# EAGLE schematic transmitter (EAGLE 9.2.0)
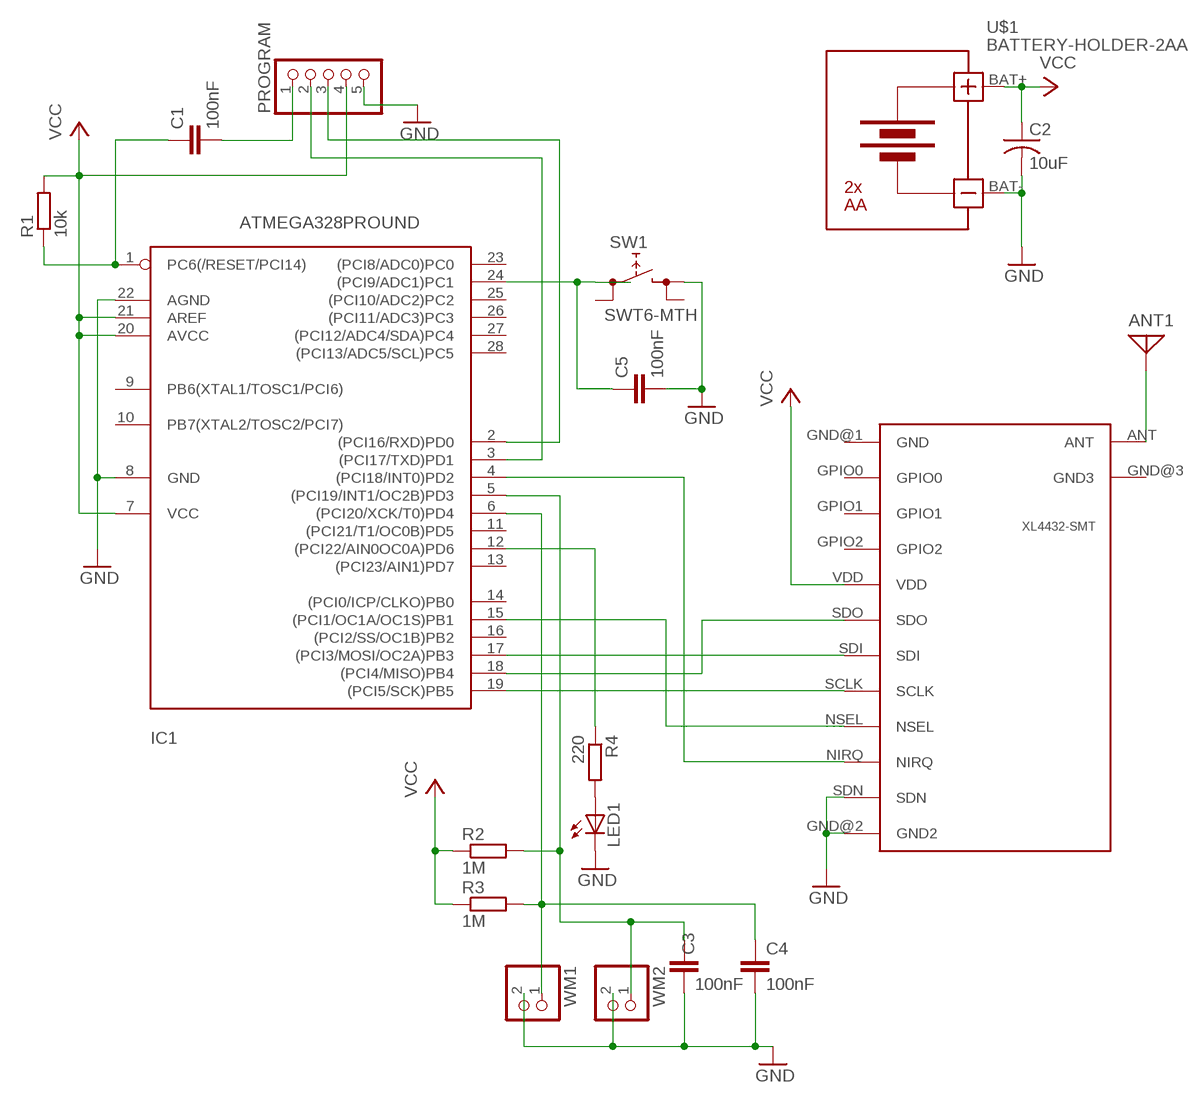
[diagram p0: schematic, sheet 1]

## Parts
4332-1  XM4432-SMT  [XL4432-SMT]
ANT1  ANTENNA  [PAD-01]
C1  100nF  C-EU025-024X044  [C025-024X044]
C2  10uF  C-US025-024X044  [C025-024X044]
C3  100nF  C-EU025-024X044  [C025-024X044]
C4  100nF  C-EU025-024X044  [C025-024X044]
C5  100nF  C-EU025-024X044  [C025-024X044]
IC1  ATMEGA328PROUND  [DIL28-3-ROUND]
LED1  LED3MM  [LED3MM]
PROGRAM  PINHD-1X5  [1X05]
R1  10k  R-EU_0204/2V  [0204V]
R2  1M  R-EU_0204/2V  [0204V]
R3  1M  R-EU_0204/2V  [0204V]
R4  220  R-EU_0204/2V  [0204V]
SW1  SWT6-MTH  [SWT6_M_TH]
U$1  BATTERY-HOLDER-2AA  [BATTERY-HOLDER-2AA]
WM1  PINHD-1X2/90  [1X02/90]
WM2  PINHD-1X2/90  [1X02/90]

## Nets
GND: 4332-1.GND@2(GND2) 4332-1.SDN C2.2 C3.2 C4.2 C5.2 IC1.8(GND) IC1.22(AGND) LED1.K(C) PROGRAM.5 SW1.P3 U$1.BAT- WM1.2 WM2.2
N$1: C1.2 PROGRAM.1
N$2: C1.1 IC1.1(PC6(/RESET/PCI14)) R1.1
N$3: IC1.3((PCI17/TXD)PD1) PROGRAM.2
N$4: IC1.2((PCI16/RXD)PD0) PROGRAM.3
N$5: C4.1 IC1.6((PCI20/XCK/T0)PD4) R3.2 WM1.1
N$6: C3.1 IC1.5((PCI19/INT1/OC2B)PD3) R2.2 WM2.1
N$7: 4332-1.SDO IC1.18((PCI4/MISO)PB4)
N$8: IC1.12((PCI22/AIN0OC0A)PD6) R4.1
N$9: 4332-1.SDI IC1.17((PCI3/MOSI/OC2A)PB3)
N$10: 4332-1.NSEL IC1.15((PCI1/OC1A/OC1S)PB1)
N$11: 4332-1.NIRQ IC1.4((PCI18/INT0)PD2)
N$12: C5.1 IC1.24((PCI9/ADC1)PC1) SW1.P1
N$13: LED1.A R4.2
N$14: 4332-1.SCLK IC1.19((PCI5/SCK)PB5)
N$15: 4332-1.ANT ANT1.1
VCC: 4332-1.VDD C2.1 IC1.7(VCC) IC1.20(AVCC) IC1.21(AREF) PROGRAM.4 R1.2 R2.1 R3.1 U$1.BAT+
Unconnected: 4332-1.GPIO0 4332-1.GPIO1 4332-1.GPIO2 IC1.9(PB6(XTAL1/TOSC1/PCI6)) IC1.10(PB7(XTAL2/TOSC2/PCI7)) IC1.11((PCI21/T1/OC0B)PD5) IC1.13((PCI23/AIN1)PD7) IC1.14((PCI0/ICP/CLKO)PB0) IC1.16((PCI2/SS/OC1B)PB2) IC1.23((PCI8/ADC0)PC0) IC1.25((PCI10/ADC2)PC2) IC1.26((PCI11/ADC3)PC3) IC1.27((PCI12/ADC4/SDA)PC4) IC1.28((PCI13/ADC5/SCL)PC5) SW1.P2 SW1.P4

## Power pins joined to a net without a drawn wire
GND: 4332-1.GND@1(GND)
GND3: 4332-1.GND@3(GND3)

## Library data of the parts
4332-1 = xl4432-smt:XM4432-SMT: XL4432-SMT Si4432 based transceiver Drawn by Will Cooke. Made available under the GPL. For full licence details please see the github page or read any copy of the GPL v2. Datasheet available here:http://www.silabs.com/Support%20Documents/TechnicalDocs/Si4430-31-32.pdf www.whizzy.org https://github.com/8none1 @8none1 <https://twitter.com/8none1>
ANT1 = discrete:ANTENNA: Antenna
C1 C3-C5 = rcl:C-EU: CAPACITOR, European symbol; SPICEPREFIX: C
C2 = rcl:C-US: CAPACITOR, American symbol; SPICEPREFIX: C
IC1 = atmega328:ATMEGA328*P: MICROCONTROLLER 32 kBytes FLASH 2 kBytes SRAM 1 kBytes EEPROM USART 8-channel 10 bit ADC
LED1 = led:LED: LED OSRAM: - CHIPLED LG R971, LG N971, LY N971, LG Q971, LY Q971, LO R971, LY R971 LH N974, LH R974 LS Q976, LO Q976, LY Q976 LO Q996 - Hyper CHIPLED LW Q18S LB Q993, LB Q99A, LB R99A - SideLED LS A670, LO A670, LY A670, LG A670, LP A670 LB A673, LV A673, LT A673, LW A673 LH A674 LY A675 LS A676, LA A676, LO A676, LY A676, LW A676 LS A679, LY A679, LG A679 - Hyper Micro SIDELED® LS Y876, LA Y876, LO Y876, LY Y876 LT Y87S - SmartLED LW L88C, LW L88S LB L89C, LB L89S, LG L890 LS L89K, LO L89K, LY L89K LS L896, LA L896, LO L896, LY L896 - TOPLED LS T670, LO T670, LY T670, LG T670, LP T670 LSG T670, LSP T670, LSY T670, LOP T670, LYG T670 LG T671, LOG T671, LSG T671 LB T673, LV T673, LT T673, LW T673 LH T674 LS T676, LA T676, LO T676, LY T676, LB T676, LH T676, LSB T676, LW T676 LB T67C, LV T67C, LT T67C, LS T67K, LO T67K, LY T67K, LW E67C LS E67B, LA E67B, LO E67B, LY E67B, LB E67C, LV E67C, LT E67C LW T67C LS T679, LY T679, LG T679 LS T770, LO T770, LY T770, LG T770, LP T770 LB T773, LV T773, LT T773, LW T773 LH T774 LS E675, LA E675, LY E675, LS T675 LS T776, LA T776, LO T776, LY T776, LB T776 LHGB T686 LT T68C, LB T68C - Hyper Mini TOPLED® LB M676 - Mini TOPLED Santana® LG M470 LS M47K, LO M47K, LY M47K Source: http://www.osram.convergy.de LUXEON: - LUMILED® LXK2-PW12-R00, LXK2-PW12-S00, LXK2-PW14-U00, LXK2-PW14-V00 LXK2-PM12-R00, LXK2-PM12-S00, LXK2-PM14-U00 LXK2-PE12-Q00, LXK2-PE12-R00, LXK2-PE12-S00, LXK2-PE14-T00, LXK2-PE14-U00 LXK2-PB12-K00, LXK2-PB12-L00, LXK2-PB12-M00, LXK2-PB14-N00, LXK2-PB14-P00, LXK2-PB14-Q00 LXK2-PR12-L00, LXK2-PR12-M00, LXK2-PR14-Q00, LXK2-PR14-R00 LXK2-PD12-Q00, LXK2-PD12-R00, LXK2-PD12-S00 LXK2-PH12-R00, LXK2-PH12-S00 LXK2-PL12-P00, LXK2-PL12-Q00, LXK2-PL12-R00 Source: www.luxeon.com KINGBRIGHT: KA-3528ASYC Source: www.kingbright.com
PROGRAM = pinhead:PINHD-1X5: PIN HEADER
R1-R4 = rcl:R-EU_: RESISTOR, European symbol; SPICEPREFIX: R
SW1 = tactile_switch:SWT6-M
U$1 = diy-modules:BATTERY-HOLDER-2AA: Battery Holder 2 x AA Click here to find device on ebay.com <http://www.ebay.com/sch/battery+plastic+holder+aa+2x1.5v>
WM1 WM2 = pinhead:PINHD-1X2: PIN HEADER